# EAGLE design pneu-grove (EAGLE 7.4.0)
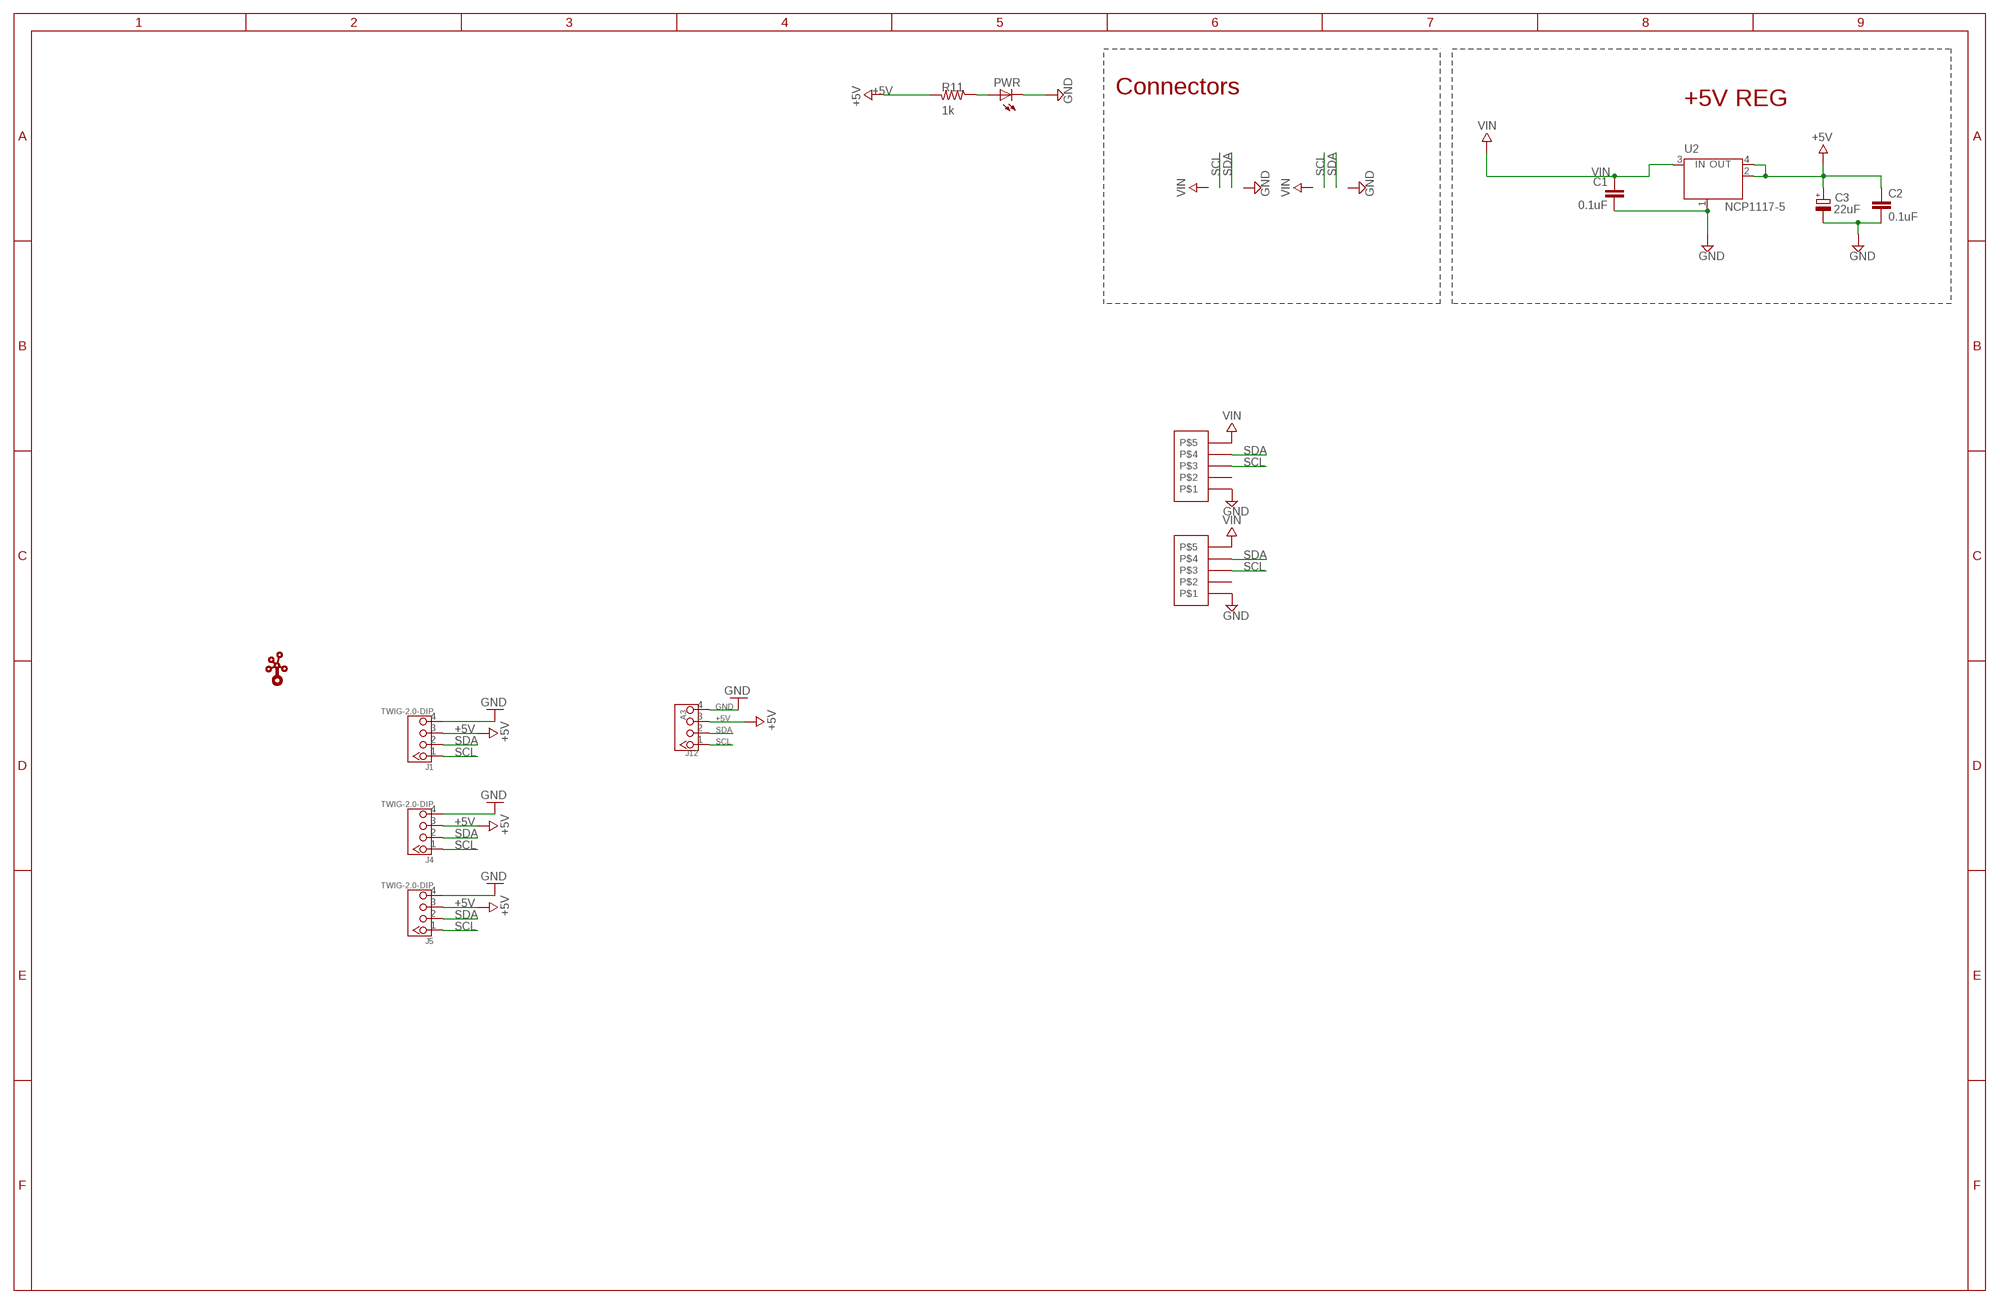
[diagram p0: schematic, sheet 1]

## Parts
C1  0.1uF  CAP0603-CAP  [0603-CAP]
C2  0.1uF  CAP0603-CAP  [0603-CAP]
C3  22uF  CPOL-EUSMCB  [SMC_B]
J1  TWIG-2.0-DIP  [2.0_1X4]
J4  TWIG-2.0-DIP  [2.0_1X4]
J5  TWIG-2.0-DIP  [2.0_1X4]
J12  A3  TWIG-4P-2.0'90D'  [4P-2.0-90D]
PWR  LEDCHIPLED_0603  [CHIPLED_0603]
R11  1k  RESISTOR0805-RES  [0805]
U2  NCP1117-5  LINEAR_MC33269ST  [LINEAR_SOT223]
U$1  TWIGLOGOTWIGLOGO_SMALL  [TWIGLOGO_SMALL]
U$23  1X05  [1X05_TIGHT]
U$24  1X05  [1X05_TIGHT]

## Nets
+5V: C2.1 C3.+ J1.3 J4.3 J5.3 J12.3 R11.2 U2.2(OUT) U2.4(OUT)
GND: C1.2 C2.2 C3.- J1.4 J4.4 J5.4 J12.4 PWR.C U2.1(GND/ADJ) U$23.P$5 U$24.P$5
N$10: PWR.A R11.1
SCL: J1.1 J4.1 J5.1 J12.1 U$23.P$3 U$24.P$3
SDA: J1.2 J4.2 J5.2 J12.2 U$23.P$2 U$24.P$2
VIN: C1.1 U2.3(IN) U$23.P$1 U$24.P$1
Unconnected: U$23.P$4 U$24.P$4

## Notes on the sheet
- Connectors
- +5V REG

## Library data of the parts
C1 C2 = SparkFun-Capacitors:CAP: Capacitor Standard 0603 ceramic capacitor, and 0.1" leaded capacitor.
C3 = rcl:CPOL-EU: POLARIZED CAPACITOR, European symbol
J1 J4 J5 = Connector:TWIG-2.0-DIP
J12 = Connector:TWIG-4P-2.0
PWR = adafruit:LED: LED OSRAM: - CHIPLED LG R971, LG N971, LY N971, LG Q971, LY Q971, LO R971, LY R971 LH N974, LH R974 LS Q976, LO Q976, LY Q976 LO Q996 - Hyper CHIPLED LW Q18S LB Q993, LB Q99A, LB R99A - SideLED LS A670, LO A670, LY A670, LG A670, LP A670 LB A673, LV A673, LT A673, LW A673 LH A674 LY A675 LS A676, LA A676, LO A676, LY A676, LW A676 LS A679, LY A679, LG A679 - Hyper Micro SIDELED® LS Y876, LA Y876, LO Y876, LY Y876 LT Y87S - SmartLED LW L88C, LW L88S LB L89C, LB L89S, LG L890 LS L89K, LO L89K, LY L89K LS L896, LA L896, LO L896, LY L896 - TOPLED LS T670, LO T670, LY T670, LG T670, LP T670 LSG T670, LSP T670, LSY T670, LOP T670, LYG T670 LG T671, LOG T671, LSG T671 LB T673, LV T673, LT T673, LW T673 LH T674 LS T676, LA T676, LO T676, LY T676, LB T676, LH T676, LSB T676, LW T676 LB T67C, LV T67C, LT T67C, LS T67K, LO T67K, LY T67K, LW E67C LS E67B, LA E67B, LO E67B, LY E67B, LB E67C, LV E67C, LT E67C LW T67C LS T679, LY T679, LG T679 LS T770, LO T770, LY T770, LG T770, LP T770 LB T773, LV T773, LT T773, LW T773 LH T774 LS E675, LA E675, LY E675, LS T675 LS T776, LA T776, LO T776, LY T776, LB T776 LHGB T686 LT T68C, LB T68C - Hyper Mini TOPLED® LB M676 - Mini TOPLED Santana® LG M470 LS M47K, LO M47K, LY M47K Source: http://www.osram.convergy.de/
R11 = SparkFun-Resistors:RESISTOR: Resistor Basic schematic elements and footprints for 0603, 1206, and PTH resistors.
U2 = SmartPrj:LINEAR_MC33269ST*: Adjustable Output Low Dropout Voltage Regulator 800 mA Source: http://www.onsemi.com/pub/Collateral/MC33269-D.PDF
U$1 = seeedleo:TWIGLOGO
U$23 U$24 = digikey:1X05

## Net classes
1 vcc: width 0.254 mm

## Board
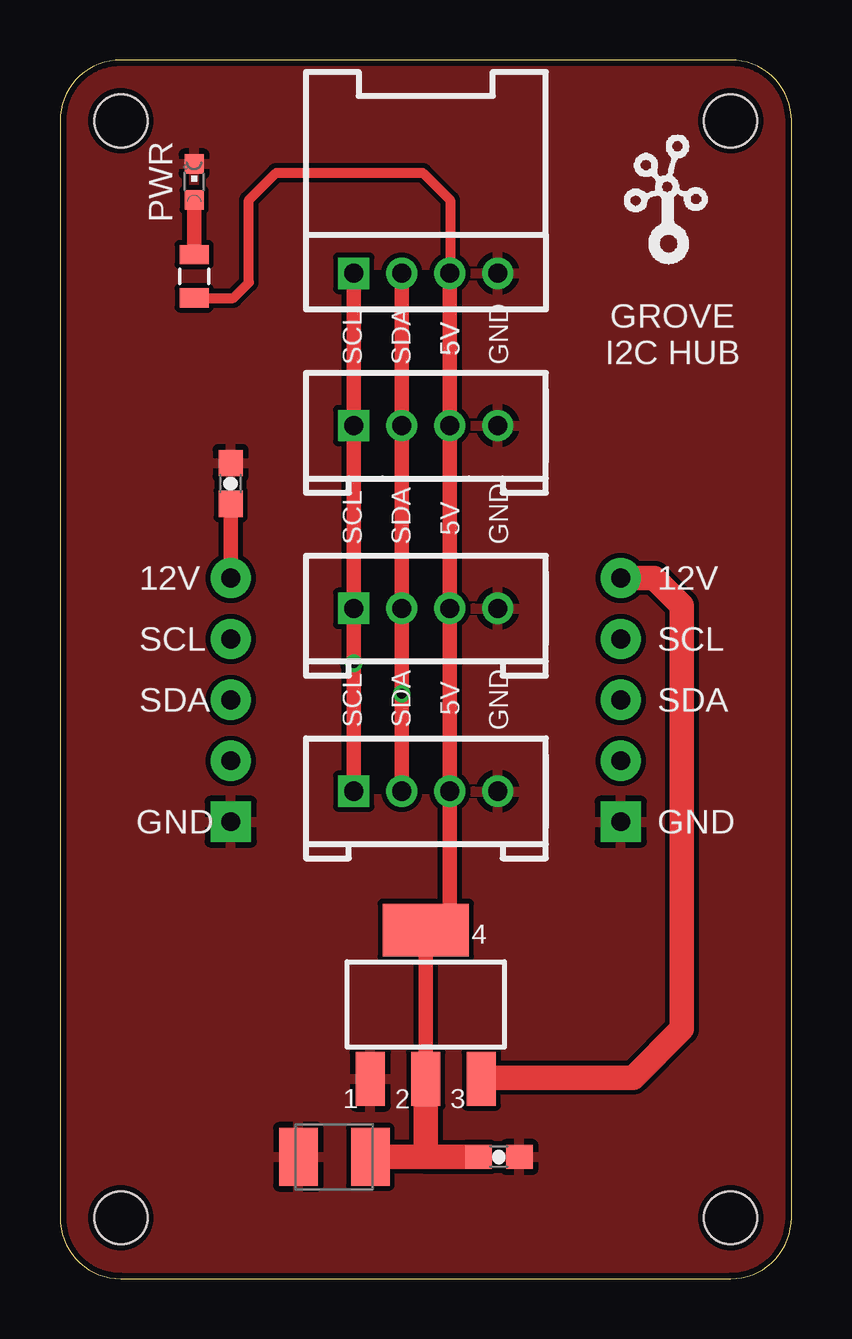
[diagram p1: board, top side]
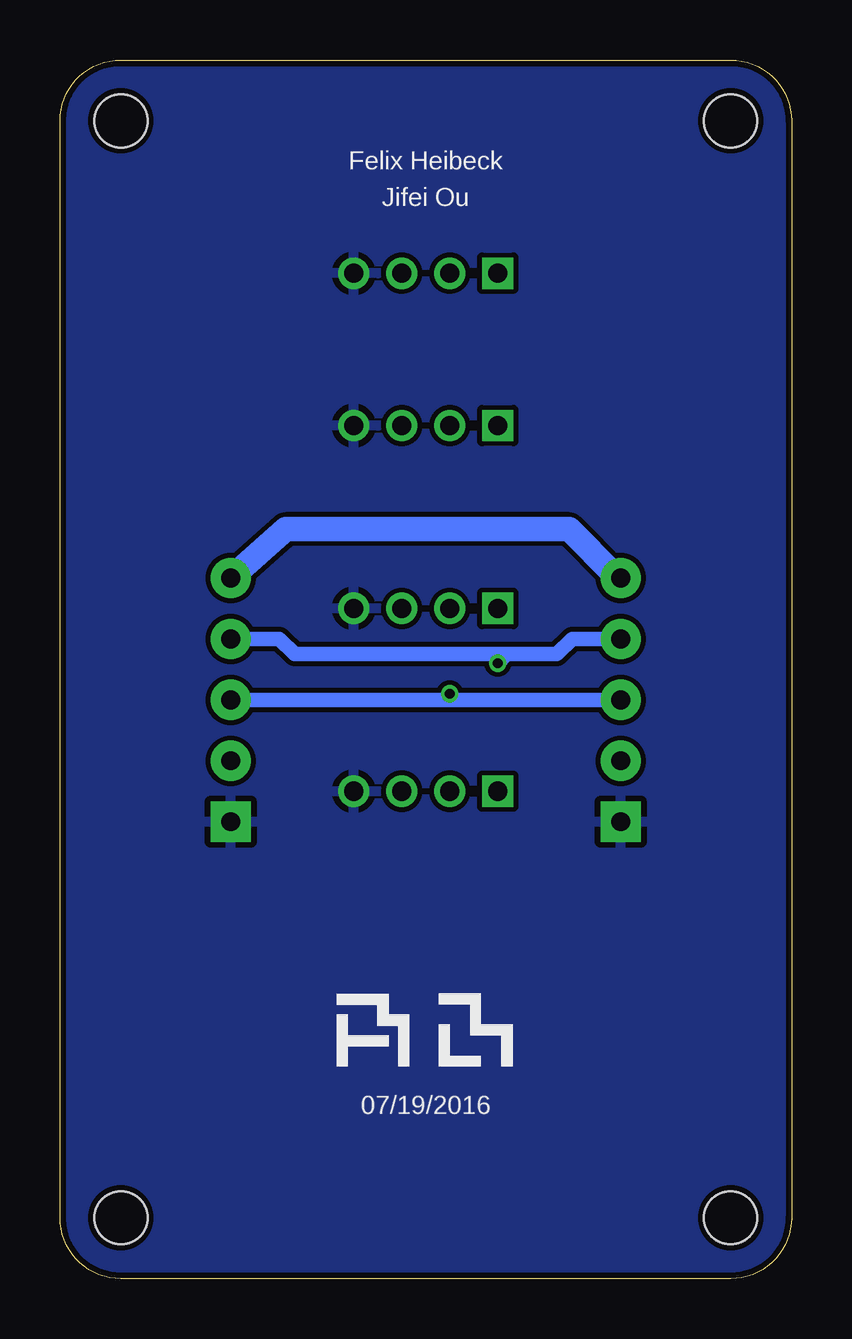
[diagram p2: board, bottom side, seen from below]

Size 30.48 x 50.8 mm. Coordinates in mm from the lower left corner, seen from the top.
Outline: 2.54,0 27.94,0 arc90 30.48,2.54 30.48,48.26 arc90 27.94,50.8 2.54,50.8 arc90 0,48.26 0,2.54 arc90 2.54,0
Copper layers (1*16): Top 0.035mm / dielectric 1.5mm / Bottom 0.035mm
Design rules "autoroute-10mil *": minimum track width 10mil, minimum drill 12mil, track to track 8mil, track to pad 8mil, pad to pad 8mil, via to via 8mil, smd to smd 0mil, copper to edge 10mil, drill to drill 10mil, minimum pad ring 10mil, minimum via ring 6mil, stop-mask expansion 2mil, vias tented up to drill 100mil, thermal gap 10mil
Holes 2.2 mm at 2.54,48.26 27.94,48.26 27.94,2.54 2.54,2.54

### Footprints (pad centres in the part's own frame; a part is rotated, then mirrored left to right if it is on the bottom)
0603-CAP = smd 1.1 x 1: 1 -0.85,0; 2 0.85,0
SMC_B = smd 1.6 x 2.4: + -1.5,0; - 1.5,0
2.0_1X4 = drill 0.8 pad 1.27 square: 1 -3,0 | drill 0.8 pad 1.27: 2 -1,0; 3 1,0; 4 3,0
4P-2.0-90D = drill 0.8 pad 1.27 square: 1 -3,0 | drill 0.8 pad 1.27: 2 -1,0; 3 1,0; 4 3,0
CHIPLED_0603 = smd 0.8 x 0.8: A 0,-0.75; C 0,0.75
0805 = smd 0.8 x 1.2: 1 -0.9,0; 2 0.9,0
LINEAR_SOT223 = smd 1.219 x 2.235: 1 -2.311,-3.099; 2 0,-3.099; 3 2.311,-3.099 | smd 3.6 x 2.2: 4 0,3.099
1X05_TIGHT = drill 0.787 pad 1.676: P$1 5.08,0; P$2 0,0; P$3 2.54,0; P$4 -2.54,0 | drill 0.787 pad 1.676 square: P$5 -5.08,0

### Placement (x,y rotation side)
C1  7.11,33.15 90 top
C2  18.29,5.08 0 top
C3  11.43,5.08 180 top
J1  15.24,35.56 0 top
J4  15.24,20.32 0 top
J5  15.24,27.94 0 top
J12  15.24,41.91 0 top
PWR  5.59,45.72 0 top
R11  5.59,41.78 270 top
U2  15.24,11.43 0 top
U$1  23.11,42.16 0 top
U$23  7.11,24.13 90 top
U$24  23.37,24.13 90 top

### Tracks (layer width: path | path; a pad name or v marks a point on that pad's centre or on a via)
+5V
  Top 0.406: R11.2 7.23,40.88 7.87,41.53 7.87,44.96 9.02,46.1 15.11,46.1 16.26,44.96 16.26,41.93 J12.3
  Top 0.61: U2.2 U2.4 16.24,14.26 J4.3 J5.3 J1.3 J12.3
  Top 1.016: U2.2 15.24,5.08 | 15.24,5.08 C2.1 | 15.24,5.08 C3.+
GND
  pour Bottom: 0.25,55.12 30.73,55.37 30.73,-2.79 0.25,-3.05
  pour Top: -1.02,54.36 30.73,54.36 30.73,-2.29 -1.02,-2.29
N$10
  Top 0.61: PWR.A R11.1
SCL  (via drill 0.41)
  Top 0.61: J12.1 J1.1 J5.1 v12.24,25.65 J4.1
  Bottom 0.61: U$23.P$3 9.14,26.67 9.78,26.04 11.86,26.04 | 11.86,26.04 20.7,26.04 21.34,26.67 U$24.P$3 | 11.86,26.04 v12.24,25.65
SDA  (via drill 0.41)
  Top 0.61: J12.2 J1.2 J5.2 v14.24,24.38 J4.2
  Bottom 0.61: U$24.P$2 U$23.P$2 13.99,24.13 v14.24,24.38
VIN
  Top 0.61: U$23.P$1 C1.1
  Top 1.016: U$24.P$1 24.77,29.21 25.91,28.07 25.91,10.41 23.88,8.38 17.6,8.38 U2.3
  Bottom 1.016: U$23.P$1 7.37,29.34 9.27,31.24 21.08,31.24 U$24.P$1

### Text on the board
tPlace: SCL | SDA | 5V | 5V | GND | SCL | SDA | 5V | GND | SCL | SDA | 5V | GND
tNames: GROVE / I2C HUB | 12V | 12V | SCL | SCL | SDA | SDA | GND | GND
bNames: Felix Heibeck | Jifei Ou | 07/19/2016